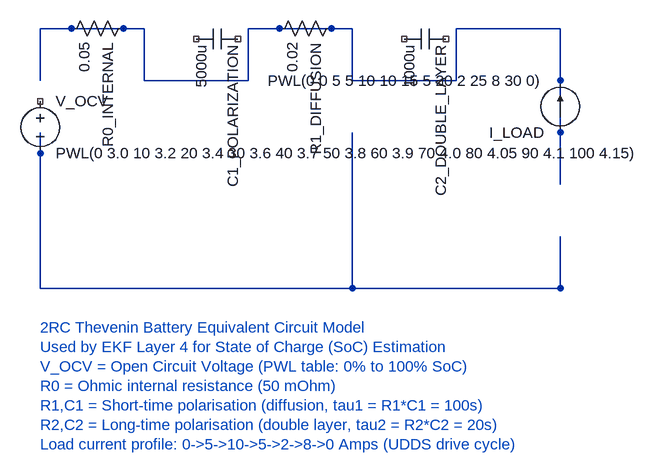
[diagram p0: schematic ekf_rc_battery_model.asc]
ekf_rc_battery_model.asc, the LTspice schematic file:
Version 4
SHEET 1 2000 1400
WIRE 80 160 80 80
WIRE 80 80 240 80
WIRE 240 80 240 160
WIRE 240 160 400 160
WIRE 400 160 400 80
WIRE 400 80 560 80
WIRE 560 80 560 160
WIRE 560 160 720 160
WIRE 720 160 720 80
WIRE 720 80 880 80
WIRE 880 80 880 320
WIRE 80 320 80 240
WIRE 560 320 560 240
WIRE 880 480 880 400
WIRE 80 480 80 320
WIRE 80 480 880 480
WIRE 560 480 560 320
WIRE 560 480 880 480
SYMBOL voltage 80 176 R0
SYMATTR InstName V_OCV
SYMATTR Value PWL(0 3.0 10 3.2 20 3.4 30 3.6 40 3.7 50 3.8 60 3.9 70 4.0 80 4.05 90 4.1 100 4.15)
SYMATTR SpiceLine Rser=0.05
SYMBOL res 224 64 R90
SYMATTR InstName R0_INTERNAL
SYMATTR Value 0.05
SYMBOL cap 384 80 R90
SYMATTR InstName C1_POLARIZATION
SYMATTR Value 5000u
SYMBOL res 544 64 R90
SYMATTR InstName R1_DIFFUSION
SYMATTR Value 0.02
SYMBOL cap 704 80 R90
SYMATTR InstName C2_DOUBLE_LAYER
SYMATTR Value 1000u
SYMBOL current 880 240 R180
SYMATTR InstName I_LOAD
SYMATTR Value PWL(0 0 5 5 10 10 15 5 20 2 25 8 30 0)
TEXT 80 540 Left 2 ;2RC Thevenin Battery Equivalent Circuit Model
TEXT 80 570 Left 2 ;Used by EKF Layer 4 for State of Charge (SoC) Estimation
TEXT 80 600 Left 2 ;V_OCV = Open Circuit Voltage (PWL table: 0% to 100% SoC)
TEXT 80 630 Left 2 ;R0 = Ohmic internal resistance (50 mOhm)
TEXT 80 660 Left 2 ;R1,C1 = Short-time polarisation (diffusion, tau1 = R1*C1 = 100s)
TEXT 80 690 Left 2 ;R2,C2 = Long-time polarisation (double layer, tau2 = R2*C2 = 20s)
TEXT 80 720 Left 2 ;Load current profile: 0->5->10->5->2->8->0 Amps (UDDS drive cycle)
.tran 0 30 0 1m
.meas TRAN SoC_start FIND V(n001) AT 0
.meas TRAN SoC_end FIND V(n001) AT 30
.backanno
.end

The netlist it stands for:
* ekf_rc_battery_model.asc
V_OCV NC_01 N002 PWL(0 3.0 10 3.2 20 3.4 30 3.6 40 3.7 50 3.8 60 3.9 70 4.0 80 4.05 90 4.1 100 4.15) Rser=0.05
R0_INTERNAL N001 N001 0.05
C1_POLARIZATION NC_02 NC_03 5000u
R1_DIFFUSION N001 N001 0.02
C2_DOUBLE_LAYER NC_04 NC_05 1000u
I_LOAD N001 N001 PWL(0 0 5 5 10 10 15 5 20 2 25 8 30 0)
* 2RC Thevenin Battery Equivalent Circuit Model
* Used by EKF Layer 4 for State of Charge (SoC) Estimation
* V_OCV = Open Circuit Voltage (PWL table: 0% to 100% SoC)
* R0 = Ohmic internal resistance (50 mOhm)
* R1,C1 = Short-time polarisation (diffusion, tau1 = R1*C1 = 100s)
* R2,C2 = Long-time polarisation (double layer, tau2 = R2*C2 = 20s)
* Load current profile: 0->5->10->5->2->8->0 Amps (UDDS drive cycle)
.backanno
.end